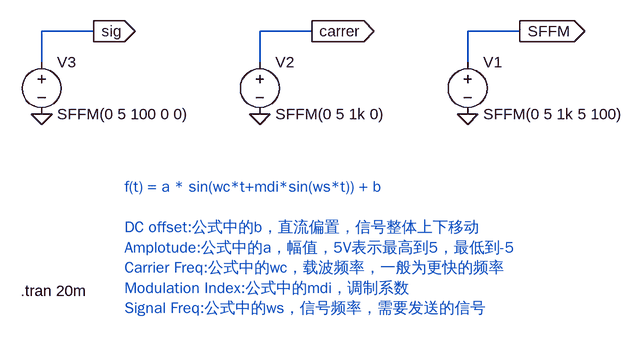
[diagram p0: schematic 06.SFFM信号.asc]
06.SFFM信号.asc, the LTspice schematic file:
Version 4
SHEET 1 880 680
WIRE -64 48 -144 48
WIRE 272 48 192 48
WIRE 592 48 512 48
WIRE -144 96 -144 48
WIRE 192 96 192 48
WIRE 512 96 512 48
FLAG 512 176 0
FLAG 592 48 SFFM
IOPIN 592 48 Out
FLAG 192 176 0
FLAG 272 48 carrer
IOPIN 272 48 Out
FLAG -144 176 0
FLAG -64 48 sig
IOPIN -64 48 Out
SYMBOL voltage 512 80 R0
WINDOW 123 0 0 Left 0
WINDOW 39 0 0 Left 0
SYMATTR InstName V1
SYMATTR Value SFFM(0 5 1k 5 100)
SYMBOL voltage 192 80 R0
WINDOW 123 0 0 Left 0
WINDOW 39 0 0 Left 0
SYMATTR InstName V2
SYMATTR Value SFFM(0 5 1k 0)
SYMBOL voltage -144 80 R0
WINDOW 123 0 0 Left 0
WINDOW 39 0 0 Left 0
SYMATTR InstName V3
SYMATTR Value SFFM(0 5 100 0 0)
TEXT -16 288 Left 2 ;f(t) = a * sin(wc*t+mdi*sin(ws*t)) + b\n \nDC offset:公式中的b，直流偏置，信号整体上下移动\nAmplotude:公式中的a，幅值，5V表示最高到5，最低到-5\nCarrier Freq:公式中的wc，载波频率，一般为更快的频率\nModulation Index:公式中的mdi，调制系数\nSignal Freq:公式中的ws，信号频率，需要发送的信号
TEXT -176 448 Left 2 !.tran 20m

The netlist it stands for:
* 06.SFFM信号.asc
V1 SFFM 0 SFFM(0 5 1k 5 100)
V2 carrer 0 SFFM(0 5 1k 0)
V3 sig 0 SFFM(0 5 100 0 0)
* f(t) = a * sin(wc*t+mdi*sin(ws*t)) + b
* DC offset:公式中的b，直流偏置，信号整体上下移动
* Amplotude:公式中的a，幅值，5V表示最高到5，最低到-5
* Carrier Freq:公式中的wc，载波频率，一般为更快的频率
* Modulation Index:公式中的mdi，调制系数
* Signal Freq:公式中的ws，信号频率，需要发送的信号
.tran 20m
.backanno
.end